# Altium schematic sheet sd-card.SchDoc
size A
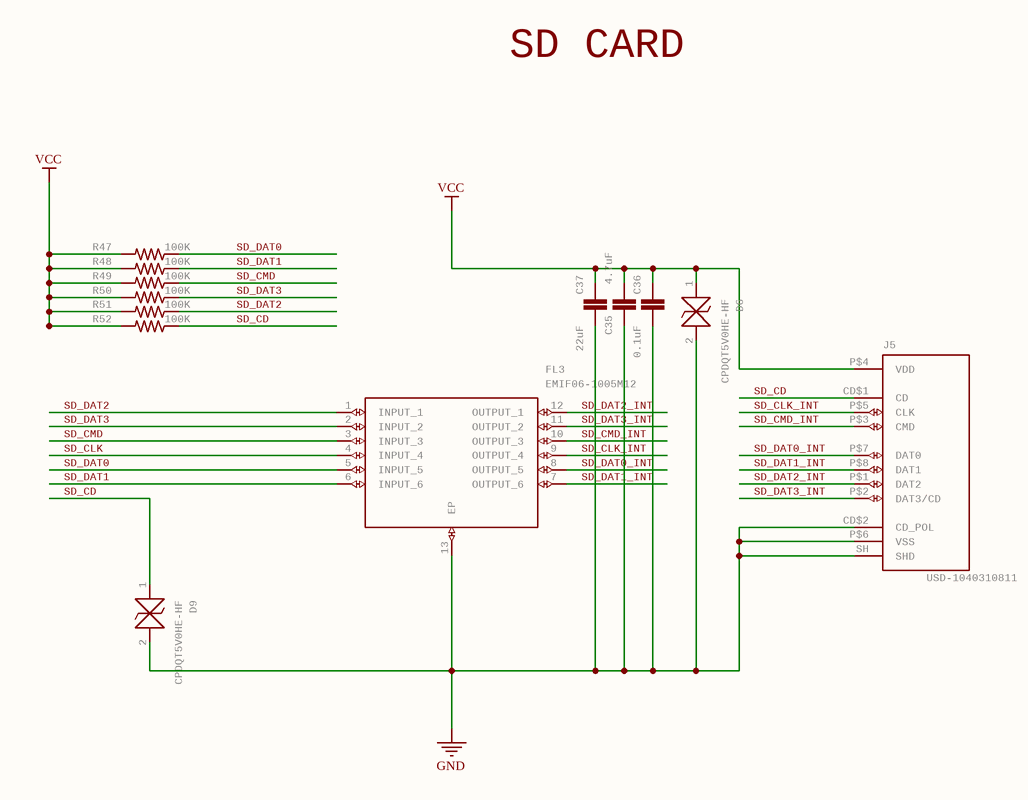
[diagram p0: sd-card.SchDoc]

## Parts
C35  4.7uF  [0402-CAP]
C36  0.1uF  [0402-CAP]
C37  22uF  [0805]
D6  CPDQT5V0HE-HF  [CPDQT5V0HEHF]
D9  CPDQT5V0HE-HF  [CPDQT5V0HEHF]
FL3  EMIF06-1005M12  [SON40P150X250X65-13N]
J5  USD-1040310811  [1040310811]
R47  100K  [0402-RES]
R48  100K  [0402-RES]
R49  100K  [0402-RES]
R50  100K  [0402-RES]
R51  100K  [0402-RES]
R52  100K  [0402-RES]

## Nets
GND: C35.1 C36.2 C37.2 D6.2 D9.2 FL3.13(EP) J5.CD$2(CD_POL) J5.P$6(VSS) J5.SH(SHD)
VCC: C35.2 C36.1 C37.1 D6.1 J5.P$4(VDD) R47.2 R48.2 R49.2 R50.2 R51.2 R52.2
SD_CD: D9.1 J5.CD$1(CD) R52.1
SD_CLK: FL3.4(INPUT_4)
SD_CLK_INT: FL3.9(OUTPUT_4) J5.P$5(CLK)
SD_CMD: FL3.3(INPUT_3) R49.1
SD_CMD_INT: FL3.10(OUTPUT_3) J5.P$3(CMD)
SD_DAT0: FL3.5(INPUT_5) R47.1
SD_DAT0_INT: FL3.8(OUTPUT_5) J5.P$7(DAT0)
SD_DAT1: FL3.6(INPUT_6) R48.1
SD_DAT1_INT: FL3.7(OUTPUT_6) J5.P$8(DAT1)
SD_DAT2: FL3.1(INPUT_1) R51.1
SD_DAT2_INT: FL3.12(OUTPUT_1) J5.P$1(DAT2)
SD_DAT3: FL3.2(INPUT_2) R50.1
SD_DAT3_INT: FL3.11(OUTPUT_2) J5.P$2(DAT3/CD)

## Notes on the sheet
- SD CARD

## Library data of the parts
C35 = CAP0402-CAP: CapacitorStandard 0603 ceramic capacitor, and 0.1" leaded capacitor.; MPN: JMK105BBJ475MV-F; GateName_1: G$1; SymbolName_1: CAP; DeviceName: 0402-CAP; LibraryName: sfe; DeviceSetName: CAP; Part Number: JMK105BBJ475MV-F
C36 = C-EUC0201: CAPACITOR, European symbol; MPN: C0402C104Z4VAC; GateName_1: G$1; SymbolName_1: C-EU; POPULARITY: 0; LibraryName: rcl; DeviceSetName: C-EU; SPICEPREFIX: C; Part Number: C0402C104Z4VAC
C37 = 22UF-0805-6.3V-20%: 22ÂµF ceramic capacitors    A capacitor is a passive two-terminal electrical component used to store electrical energy temporarily in an electric field.; MPN: CL21A226MQQNNNE; GateName_1: G$1; SymbolName_1: CAP; PROD_ID: CAP-08402; DeviceName: -0805-6.3V-20%; LibraryName: SparkFun-Capacitors; DeviceSetName: 22UF; Part Number: CL21A226MQQNNNE
D6 D9 = CPDQT5V0HE-HF: ESD Suppressors / TVS Diodes DIODE ESD 5VWM 65W 0402/SOD-923F   Source:  Datasheet; MANUFACTURER_NAME: Comchip Technology; GateName_1: G$1; SymbolName_1: CPDQT5V0HE-HF; LibraryName: CPDQT5V0HE-HF; DeviceSetName: CPDQT5V0HE-HF; HEIGHT: 0.42mm; MANUFACTURER_PART_NUMBER: CPDQT5V0HE-HF; MOUSER_PART_NUMBER: MOUSER_PART_NUMBER; MOUSER_PRICE-STOCK: MOUSER_PRICE-STOCK; MPN: CPDQT5V0HE-HF; Part Number: CPDQT5V0HE-HF
FL3 = EMIF06-1005M12: EMI Filter Circuits 6lin lw cpcitnc EMI 45pF -35db @ 900MHz   Source:  Datasheet; MANUFACTURER_NAME: STMicroelectronics; GateName_1: G$1; SymbolName_1: EMIF06-1005M12; LibraryName: EMIF06-1005M12; DeviceSetName: EMIF06-1005M12; HEIGHT: 0.65mm; MANUFACTURER_PART_NUMBER: EMIF06-1005M12; MOUSER_PART_NUMBER: 511-EMIF06-1005M12; MOUSER_PRICE-STOCK: https://www.mouser.co.uk/ProductDetail/STMicroelectronics/EMIF06-1005M12?qs=VJaATVMq%252BXo0u09ZqtQg3A%3D%3D; MPN: EMIF06-1005M12; Part Number: EMIF06-1005M12
J5 = USD-1040310811: uSD Slot; MPN: 104031-0811; GateName_1: G$1; SymbolName_1: USD; LibraryName: 1040310811; DeviceSetName: USD-1040310811; Part Number: 104031-0811
R47-R52 = RESISTOR0402-RES: ResistorBasic schematic elements and footprints for 0603, 1206, and PTH resistors.; MPN: AC0402FR-07100KL; GateName_1: G$1; SymbolName_1: RESISTOR; DeviceName: 0402-RES; LibraryName: sfe; DeviceSetName: RESISTOR; Part Number: AC0402FR-07100KL